# Altium project ClockLED_ONE.PrjPcb
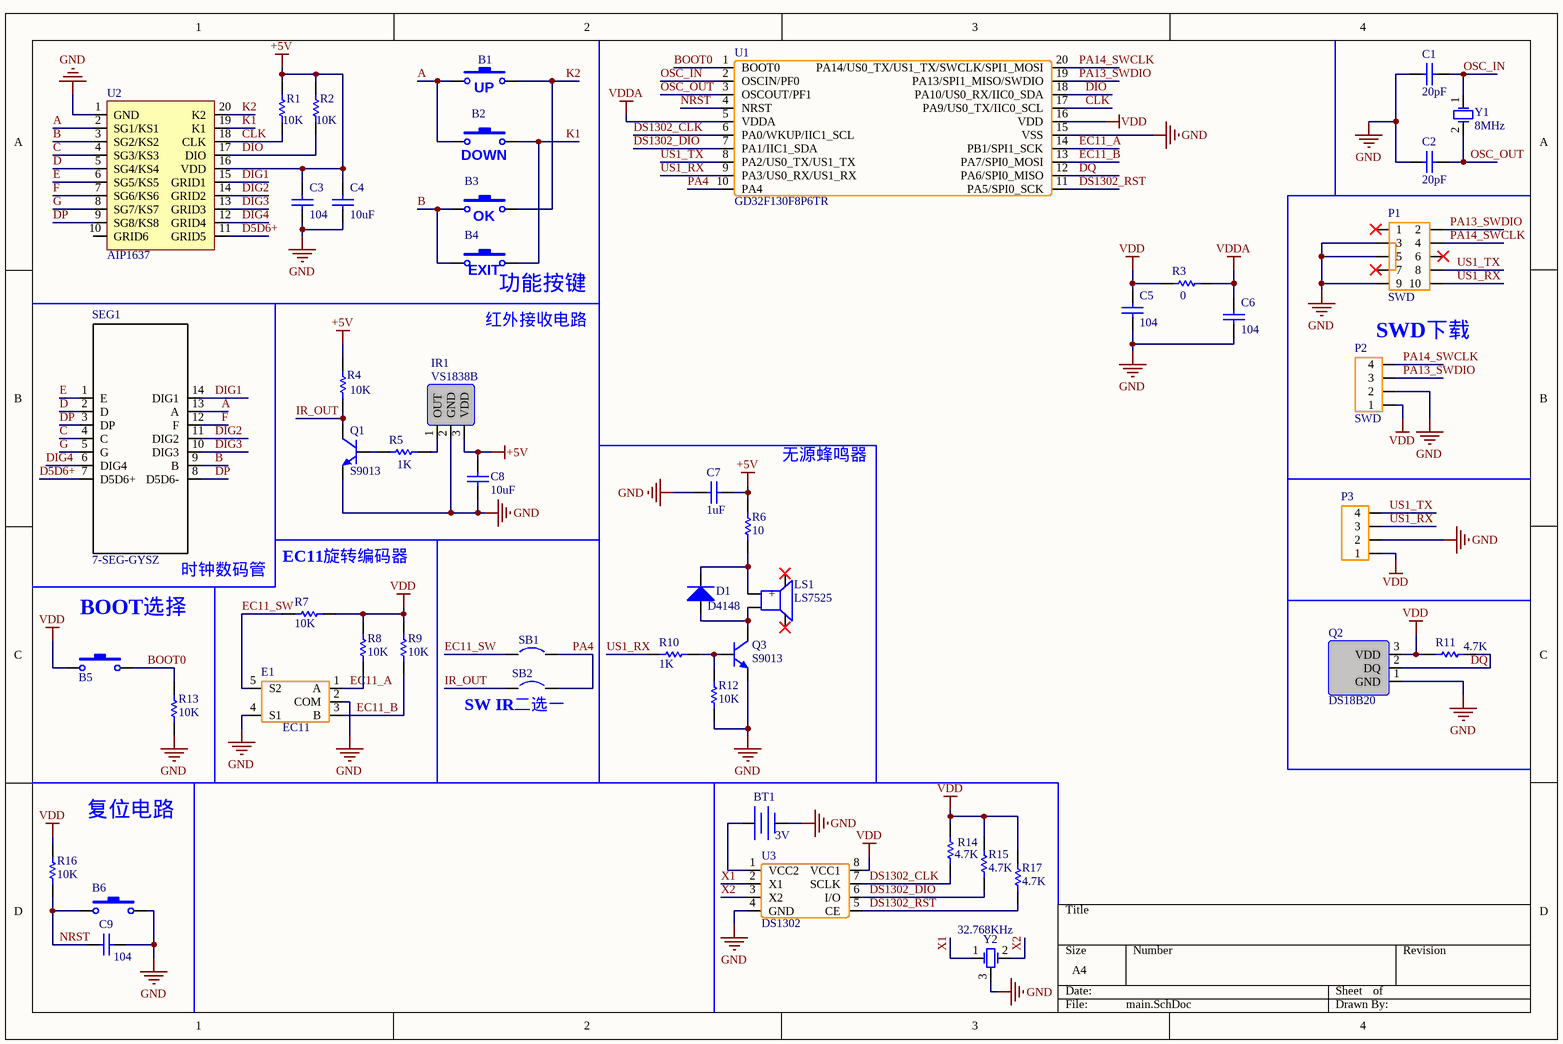
[diagram p0: main.SchDoc]
2 sheets, 82 parts. Net scope: global (net labels, ports and power ports of the same name join across sheets).
Board file: ClockLED_ONE.PcbDoc
Sheets:
  main.SchDoc
  Power.SchDoc

## Sheet main.SchDoc
size A4; SheetNumber: 1; SheetTotal: 2

### Parts
B1  用户按钮  [SW-SMD_L6.0-W3.5-LS8.0]  (value not drawn)
B2  用户按钮  [SW-SMD_L6.0-W3.5-LS8.0]  (value not drawn)
B3  用户按钮  [SW-SMD_L6.0-W3.5-LS8.0]  (value not drawn)
B4  用户按钮  [SW-SMD_L6.0-W3.5-LS8.0]  (value not drawn)
B5  复位按钮  [SW-SMD_L6.0-W3.5-LS8.0]  (value not drawn)
B6  复位按钮  [SW-SMD_L6.0-W3.5-LS8.0]  (value not drawn)
BT1  3V  [BAT-SMD_CR1220-2]
C1  value 20pF  [C0603]  (hidden comment: Cap)
C2  value 20pF  [C0603]  (hidden comment: Cap)
C3  value 104  [C0603]  (hidden comment: Cap)
C4  value 10uF  [C1812]  (hidden comment: Cap)
C5  value 104  [C0603]  (hidden comment: Cap)
C6  value 104  [C0603]  (hidden comment: Cap)
C7  value 1uF  [C1206]  (hidden comment: Cap)
C8  value 10uF  [C1210]  (hidden comment: Cap)
C9  value 104  [C0603]  (hidden comment: Cap)
D1  D4148  [SOD-80_L3.5-W1.5-RD]
E1  EC11  [EC11]
IR1  VS1838B  [HS0038]
LS1  LS7525  [BUZ-SMD_4P-7525]
P1  SWD  [IDC-SMD-10P-1.27MM]
P2  SWD  [HDR1X4-Male]
P3  HDR-M-2.54-1x4  [HDR1X4-Male]  (value not drawn)
Q1  S9013  [SOT-23-3_L2.9-W1.6-P1.90-LS2.8-BR]
Q2  DS18B20  [TO-92A]
Q3  S9013  [SOT-23-3_L2.9-W1.6-P1.90-LS2.8-BR]
R1  value 10K  [R0603]  (hidden comment: Res)
R2  value 10K  [R0603]  (hidden comment: Res)
R3  value 0  [R0603]  (hidden comment: Res)
R4  value 10K  [R0603]  (hidden comment: Res)
R5  value 1K  [R0603]  (hidden comment: Res)
R6  value 10  [R0603]  (hidden comment: Res)
R7  value 10K  [R0603]  (hidden comment: Res)
R8  value 10K  [R0603]  (hidden comment: Res)
R9  value 10K  [R0603]  (hidden comment: Res)
R10  value 1K  [R0603]  (hidden comment: Res)
R11  value 4.7K  [R0603]  (hidden comment: Res)
R12  value 10K  [R0603]  (hidden comment: Res)
R13  value 10K  [R0603]  (hidden comment: Res)
R14  value 4.7K  [R0603]  (hidden comment: Res)
R15  value 4.7K  [R0603]  (hidden comment: Res)
R16  value 10K  [R0603]  (hidden comment: Res)
R17  value 4.7K  [R0603]  (hidden comment: Res)
SB1  Circuit Breaker  [JP2_SMD]  (value not drawn)
SB2  Circuit Breaker  [JP2_SMD]  (value not drawn)
SEG1  7-SEG-GYSZ  [7-SEG-GY0_8INCH]
U1  GD32F130F8P6TR  [TSSOP-20-N]
U2  AIP1637  [SOP-20_L12.8-W7.5-P1.27-LS10.4-BL]
U3  DS1302  [SOIC-8_208mil_L5.3-W5.3-P1.27-LS8.0-BL]
Y1  8MHz  [HC-49]
Y2  32.768KHz  [CRYSTAL-SMD_BD2.0-L6.0-P2.54-32.768]

### Nets
+5V: C3.2 C4.2 C7.1 C8.1 IR1.3(VDD) R1.2 R2.2 R4.1 R6.2 U2.16(VDD)
GND: B6.2 BT1.2(-) C1.1 C2.1 C3.1 C4.1 C5.1 C6.1 C7.2 C8.2 C9.2 E1.2(COM) E1.4(S1) IR1.2(GND) P1.3 P1.5 P1.9 P2.2 P3.2 Q1.2(E) Q2.1(GND) Q3.2(E) R12.2 R13.1 U1.15(VSS) U2.1(GND) U3.4(GND) Y2.3(GND)
VDD: B5.1 C5.2 P2.1 P3.1 Q2.3(VDD) R3.2 R7.1 R8.2 R9.2 R11.2 R14.1 R15.1 R16.2 R17.1 U1.16(VDD) U3.8(VCC1)
VDDA: C6.2 R3.1 U1.5(VDDA)
A: B1.1 B2.1 SEG1.13(A) U2.2(SG1/KS1)
B: B3.1 B4.1 SEG1.9(B) U2.3(SG2/KS2)
BOOT0: B5.2 R13.2 U1.1(BOOT0)
C: SEG1.4(C) U2.4(SG3/KS3)
CLK: R1.1 U1.17(PA9/US0_TX/IIC0_SCL) U2.18(CLK)
D: SEG1.2(D) U2.5(SG4/KS4)
D5D6+: SEG1.7(D5D6+) U2.11(GRID5)
DIG1: SEG1.14(DIG1) U2.15(GRID1)
DIG2: SEG1.11(DIG2) U2.14(GRID2)
DIG3: SEG1.10(DIG3) U2.13(GRID3)
DIG4: SEG1.6(DIG4) U2.12(GRID4)
DIO: R2.1 U1.18(PA10/US0_RX/IIC0_SDA) U2.17(DIO)
DP: SEG1.3(DP) SEG1.8(D5D6-) U2.9(SG8/KS8)
DQ: Q2.2(DQ) R11.1 U1.12(PA6/SPI0_MISO)
DS1302_CLK: R14.2 U1.6(PA0/WKUP/IIC1_SCL) U3.7(SCLK)
DS1302_DIO: R15.2 U1.7(PA1/IIC1_SDA) U3.6(I/O)
DS1302_RST: R17.2 U1.11(PA5/SPI0_SCK) U3.5(CE)
E: SEG1.1(E) U2.6(SG5/KS5)
EC11_A: E1.1(A) R8.1 U1.14(PB1/SPI1_SCK)
EC11_B: E1.3(B) R9.1 U1.13(PA7/SPI0_MOSI)
EC11_SW: E1.5(S2) R7.2 SB1.1
F: SEG1.12(F) U2.7(SG6/KS6)
G: SEG1.5(G) U2.8(SG7/KS7)
IR_OUT: Q1.3(C) R4.2 SB2.1
K1: B2.2 B4.2 U2.19(K1)
K2: B1.2 B3.2 U2.20(K2)
NRST: B6.1 C9.1 R16.1 U1.4(NRST)
OSC_IN: C1.2 U1.2(OSCIN/PF0) Y1.1(OSC1)
OSC_OUT: C2.2 U1.3(OSCOUT/PF1) Y1.2(OSC2)
PA4: SB1.2 SB2.2 U1.10(PA4)
PA13_SWDIO: P1.2 P2.3 U1.19(PA13/SPI1_MISO/SWDIO)
PA14_SWCLK: P1.4 P2.4 U1.20(PA14/US0_TX/US1_TX/SWCLK/SPI1_MOSI)
US1_RX: P1.10 P3.3 R10.2 U1.9(PA3/US0_RX/US1_RX)
US1_TX: P1.8 P3.4 U1.8(PA2/US0_TX/US1_TX)
X1: U3.2(X1) Y2.1(OSC1)
X2: U3.3(X2) Y2.2(OSC2)
NetBT1_1: BT1.1(+) U3.1(VCC2)
NetD1_1: D1.1(K) LS1.1(+) R6.1
NetD1_2: D1.2(A) LS1.2(-) Q3.3(C)
NetIR1_1: IR1.1(OUT) R5.1
NetQ1_1: Q1.1(B) R5.2
NetQ3_1: Q3.1(B) R10.1 R12.1

Not connected (* = marked no-connect by the designer): LS1 3* 4*; P1 1* 6* 7*; U2 10(GRID6)

### Notes on the sheet
- (near B1) UP
- (near B2) DOWN
- (near B3) OK
- (near B4) EXIT
- (near B4) 功能按键
- (near B4) 红外接收电路
- (near P2) SWD下载
- 无源蜂鸣器
- 时钟数码管
- EC11旋转编码器
- (near B5) BOOT选择
- (near SB2) SW IR二选一
- (near R16) 复位电路

### Library data of the parts
B1-B6 = Button: 轻触按钮 - Switch; Published: 24-Mar-1999; LatestRevisionDate: 17-Jul-2002; LatestRevisionNote: Re-released for DXP Platform.; PackageReference: SPST-2; Publisher: Altium Limited; PackageDescription: Switch; 2 Leads
BT1 = Battery: 电池
C1-C9 = Cap: 无极性电容; Publisher: 信念D力量
D1 = D4148: 4148二极管
E1 = EC11: EC11 旋转编码器，一圈20个脉冲
IR1 = VS1838B: 红外接收管
LS1 = LS7525: 扬声器 - Loudspeaker; Published: 24-Mar-1999; LatestRevisionDate: 17-Jul-2002; LatestRevisionNote: Re-released for DXP Platform.; PackageReference: PIN2; Publisher: Altium Limited
P1 = IDC-2x5: 牛角座
P2 P3 = HDR-M-2.54-1x4: 排针，2.54MM
Q1 Q3 = S9013: NPN 三极管; ComponentLink1Description: Manufacturer Link; ComponentLink2Description: Datasheet
Q2 = DS18B20: 温度传感器
R1-R17 = Res: 美国电阻符号; Published: 8-Jun-2000; LatestRevisionDate: 29-May-2009; LatestRevisionNote: IPC-7351 Footprint Added.; PackageReference: J1-0603; Publisher: Altium Limited; PackageDescription: Chip Resistor
SB1 SB2 = Circuit Breaker: 断路器 短路选择 - Circuit Breaker; Solder: NO; Published: 24-Mar-1999; Revision: July-2002: Re-released for DXP Platform.; Publisher: Altium Limited
SEG1 = 7-SEG-GYSZ: 4位共阳极数码管 带时钟显示
U1 = GD32F130F8P6TR: GD32单片机 RAM 8KB Flash 64KB
U2 = AIP1637: 数码管驱动
U3 = DS1302: 时钟芯片
Y1 = XTAL: 晶振 - Crystal Oscillator; Published: 8-Jun-2000; LatestRevisionDate: 17-Jul-2002; LatestRevisionNote: Re-released for DXP Platform.; PackageReference: R38; Publisher: Altium Limited; PackageDescription: Crystal, Thru-Hole; 2 Leads; Body 3.1 x 8.2 mm (Dia.xH)
Y2 = XTAL-3: 晶振 - Crystal Oscillator; Published: 8-Jun-2000; LatestRevisionDate: 17-Jul-2002; LatestRevisionNote: Re-released for DXP Platform.; PackageReference: R38; Publisher: Altium Limited; PackageDescription: Crystal, Thru-Hole; 2 Leads; Body 3.1 x 8.2 mm (Dia.xH)

## Sheet Power.SchDoc
size A4; SheetNumber: 2; SheetTotal: 2
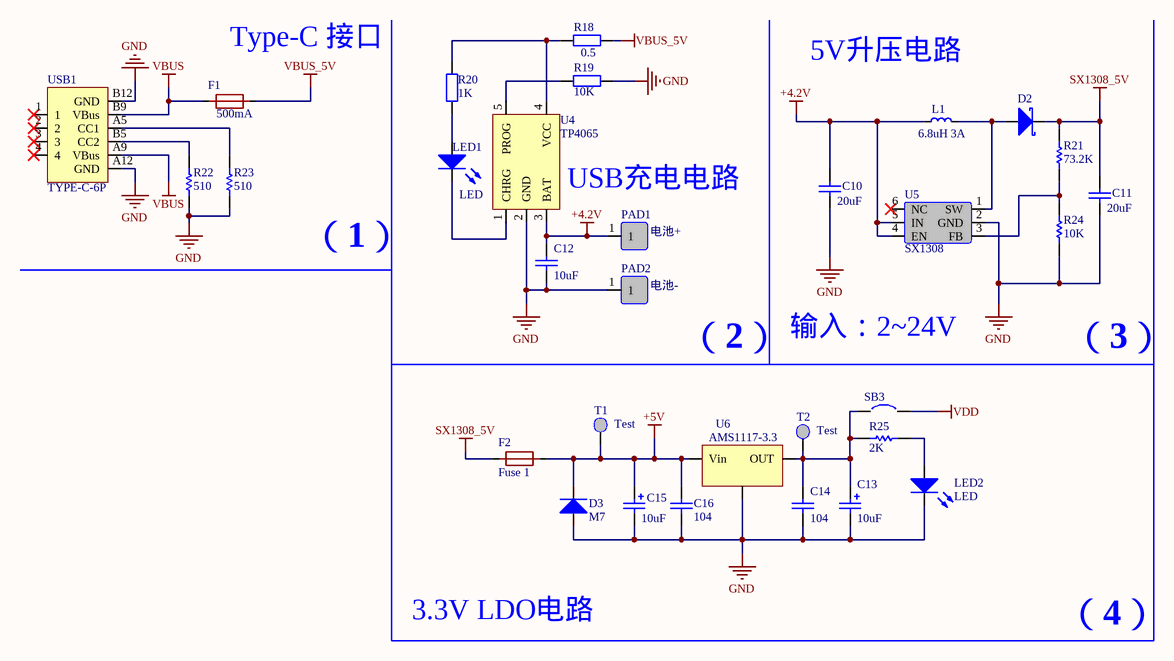
[diagram p1: Power.SchDoc]

### Parts
C10  value 20uF  [C1210]  (hidden comment: Cap)
C11  value 20uF  [C1210]  (hidden comment: Cap)
C12  value 10uF  [C0603]  (hidden comment: Cap)
C13  value 10uF  [CASE-A_3216]  (hidden comment: Cap Pol1)
C14  value 104  [C0603]  (hidden comment: Cap)
C15  value 10uF  [CASE-A_3216]  (hidden comment: Cap Pol1)
C16  value 104  [C0603]  (hidden comment: Cap)
D2  D Schottky  [SMA_L4.4-W2.8-LS5.4-RD]  (value not drawn)
D3  M7  [SOD-123_L2.8-W1.8-LS3.7-RD]
F1  500mA  [F0603]
F2  Fuse 1  [F0603]
L1  value 6.8uH 3A  [IND-SMD_L6.0-W6.0_SWPA6045S]  (hidden comment: Inductor)
LED1  LED  [LED0603_RED]
LED2  LED  [LED0603_RED]
PAD1  电池+  [PAD_1]
PAD2  电池-  [PAD_1]
R18  value 0.5  [R0805]  (hidden comment: Res_EU)
R19  value 10K  [R0603]  (hidden comment: Res_EU)
R20  value 1K  [R0603]  (hidden comment: Res_EU)
R21  value 73.2K  [R0603]  (hidden comment: Res)
R22  value 510  [R0603]  (hidden comment: Res)
R23  value 510  [R0603]  (hidden comment: Res)
R24  value 10K  [R0603]  (hidden comment: Res)
R25  value 2K  [R0603]  (hidden comment: Res)
SB3  Circuit Breaker  [JP2_SMD]  (value not drawn)
T1  Test  [TEST-SMD]
T2  Test  [TEST-SMD]
U4  TP4065  [SOT-23-5L]
U5  SX1308  [SOT-23-6_L2.9-W1.6-P0.95-LS2.8-BR]
U6  AMS1117-3.3  [SOT-223_L6.7-W3.5-P2.30-BR]
USB1  TYPE-C-6P  [USB-C-SMD_6P]

### Nets
+4.2V: C10.2 C12.2 L1.1 PAD1.1 U4.3(BAT) U5.4(EN) U5.5(IN)
+5V: C15.1 C16.2 D3.1(K) F2.2 T1.1(TEST) U6.3(Vin)
GND: C10.1 C11.1 C12.1 C13.2 C14.1 C15.2 C16.1 D3.2(A) LED2.2(K) PAD2.1 R19.1 R22.2 R23.2 R24.2 U4.2(GND) U5.2(GND) U6.1(GND) USB1.A12(GND) USB1.B12(GND)
SX1308_5V: C11.2 D2.2(K) F2.1 R21.1
VBUS: F1.1 USB1.A9(VBus) USB1.B9(VBus)
VBUS_5V: F1.2 R18.1
VDD: SB3.2
NetC13_1: C13.1 C14.2 R25.2 SB3.1 T2.1(TEST) U6.2(OUT)
NetD2_1: D2.1(A) L1.2 U5.1(SW)
NetLED1_1: LED1.1(A) R20.1
NetLED1_2: LED1.2(K) U4.1(CHRG)
NetLED2_1: LED2.1(A) R25.1
NetR18_2: R18.2 R20.2 U4.4(VCC)
NetR19_2: R19.2 U4.5(PROG)
NetR21_2: R21.2 R24.1 U5.3(FB)
NetR22_1: R22.1 USB1.B5(CC2)
NetR23_1: R23.1 USB1.A5(CC1)

Not connected (* = marked no-connect by the designer): U5 6(NC)*; USB1 1* 2* 3* 4*

### Notes on the sheet
- (near F1) Type-C 接口
- 5V升压电路
- (near U4) USB充电电路
- （1）
- （2）
- 输入：2~24V
- （3）
- 3.3V LDO电路
- （4）

### Library data of the parts
C10-C12 C14 C16 = Cap: 无极性电容; Publisher: 信念D力量
C13 C15 = Cap Pol1: 有极性电容; Published: 2020-7-27; Publisher: 信念D力量; LCSC_ID: C18104
D2 = D Schottky: 肖特基二极管; Published: 8-Jun-2000; LatestRevisionDate: 17-Jul-2002; LatestRevisionNote: Re-released for DXP Platform.; PackageReference: SMB; Publisher: Altium Limited; PackageDescription: DO-214-AA/SMB; 2 C-Bend Leads; Body 5.3 x 3.6 mm, inc. leads (LxW); Code_JEDEC: DO-214-AA
D3 = 1N4007: 1N4007 二极管
F1 F2 = Fuse 1: 保险丝 - Fuse
L1 = Inductor: 电感 - Inductor; Code_IEC: 1005; Published: 8-Jun-2000; LatestRevisionDate: 29-May-2009; LatestRevisionNote: IPC-7351 Footprint Added.; PackageReference: 0402-A; Publisher: Altium Limited; PackageDescription: Chip Inductor; Code_JEITA: 0402
LED1 LED2 = LED: 发光二极管
PAD1 PAD2 = PAD_1
R18-R20 = Res_EU: 欧盟电阻符号; Published: 8-Jun-2000; LatestRevisionDate: 17-Jul-2002
R21-R25 = Res: 美国电阻符号; Published: 8-Jun-2000; LatestRevisionDate: 29-May-2009; LatestRevisionNote: IPC-7351 Footprint Added.; PackageReference: J1-0603; Publisher: Altium Limited; PackageDescription: Chip Resistor
SB3 = Circuit Breaker: 断路器 短路选择 - Circuit Breaker; Solder: NO; Published: 24-Mar-1999; Revision: July-2002: Re-released for DXP Platform.; Publisher: Altium Limited
U4 = TP4065: 电池管理IC
U5 = SX1308: DC-DC电源芯片  DC-DC电源芯片 2V~24V
U6 = AMS1117-3.3: 线性稳压芯片 - Voltage Regulator
USB1 = TYPE-C-6P: Type-C USB，6P

## Nets that join several sheets
+5V: main (10 pins), Power (6 pins)
GND: main (28 pins), Power (19 pins)
VDD: main (16 pins), Power (SB3.2)